# Altium schematic sheet USB_UART.SchDoc
size A4
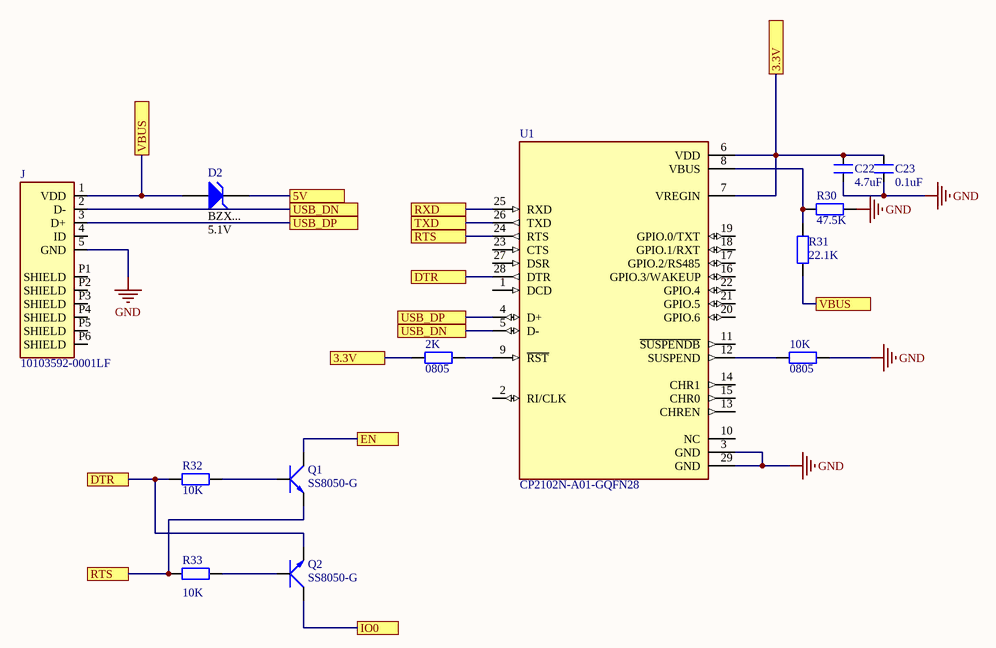
[diagram p0: USB_UART.SchDoc]

## Parts
2K  value 0805  [DIEN TRO 0805]  (hidden comment: RES_SMD_0805)
10K  value 0805  [DIEN TRO 0805]  (hidden comment: RES_SMD_0805)
C22  4.7uF  [SM-0805]
C23  0.1uF  [SM-0805]
D2  value BZX...  Volt: 5.1V  [D1208]  (hidden comment: Diode Zener)
J  10103592-0001LF  [AMPHENOL_10103592-0001LF]
Q1  SS8050-G  [SOT23B]
Q2  SS8050-G  [SOT23B]
R30  value 47.5K  [DIEN TRO 0805]  (hidden comment: RES_SMD_0805)
R31  value 22.1K  [DIEN TRO 0805]  (hidden comment: RES_SMD_0805)
R32  value 10K  [DIEN TRO 0805]  (hidden comment: RES_SMD_0805)
R33  value 10K  [DIEN TRO 0805]  (hidden comment: RES_SMD_0805)
U1  CP2102N-A01-GQFN28  [QFN50P500X500X80-29N]

## Ports
3.3V, 5V, DTR, EN, IO0, RTS, RXD, TXD, USB_DN, USB_DP, VBUS

## Nets
GND: 10K.2 C22.1 C23.1 J.5(GND) R30.2 U1.3(GND) U1.29(GND)
3.3V: 2K.1 C22.2 C23.2 U1.6(VDD) U1.7(VREGIN) ; port 3.3V
5V: D2.2(K) ; port 5V
DTR: Q2.1(E) R32.1 U1.28(DTR) ; port DTR
EN: Q1.2(C) ; port EN
IO0: Q2.2(C) ; port IO0
RTS: Q1.1(E) R33.1 U1.24(RTS) ; port RTS
RXD: U1.25(RXD) ; port RXD
TXD: U1.26(TXD) ; port TXD
USB_DN: J.2(D-) U1.5(D-) ; port USB_DN
USB_DP: J.3(D+) U1.4(D+) ; port USB_DP
VBUS: D2.1(A) J.1(VDD) R31.1 ; port VBUS
Net2K_2: 2K.2 U1.9(~{RST})
Net10K_1: 10K.1 U1.12(SUSPEND)
NetQ1_3: Q1.3(B) R32.2
NetQ2_3: Q2.3(B) R33.2
NetR30_1: R30.1 R31.2 U1.8(VBUS)

Not connected (* = marked no-connect by the designer): J 4(ID) P1(SHIELD) P2(SHIELD) P3(SHIELD) P4(SHIELD) P5(SHIELD) P6(SHIELD); U1 1(DCD) 2(RI/CLK) 10(NC) 11(~{SUSPENDB}) 13(CHREN) 14(CHR1) 15(CHR0) 16(GPIO.3/WAKEUP) 17(GPIO.2/RS485) 18(GPIO.1/RXT) 19(GPIO.0/TXT) 20(GPIO.6) 21(GPIO.5) 22(GPIO.4) 23(CTS) 27(DSR)

## Library data of the parts
2K 10K R30-R33 = RES_SMD_0805: RES_0805; Published: 8-Jun-2000; LatestRevisionDate: 17-Jul-2002; LatestRevisionNote: Re-released for DXP Platform.; PackageReference: AXIAL-0.4; Publisher: Altium Limited
C22 C23 = CM: Cap SMD; Value: 103
D2 = Diode Zener: Zener Diode; Vendor: Digikey; Published: 8-Jun-2000; LatestRevisionDate: 17-Jul-2002; LatestRevisionNote: Re-released for DXP Platform.; PackageReference: DIODE-0.7; Publisher: Altium Limited; ComponentLink1Description: Digikey Part Link; ComponentLink2Description: Open Datasheet; ComponentLink2URL: H:\LIBRARY\LIBRARY.Datasheet\
J = 10103592-0001LF: USB - micro B USB 2.0 Receptacle Connector 5 Position Surface Mount, Right Angle; Through Hole; MF: Amphenol ICC; SnapEDA_Link: https://www.snapeda.com/parts/10103592-0001LF/Amphenol%20FCI/view-part/1274744/?ref=snap; Availability: Unavailable; Value: *; Price: None; MP: 10103592-0001LF; Package: None
Q1 Q2 = C1815_1: NPN 600mW, ECB; Value: C1815
U1 = CP2102N-A01-GQFN28: USB Bridge, USB to UART USB 2.0 UART Interface 28-QFN (5x5); MF: Silicon Labs; SnapEDA_Link: https://www.snapeda.com/parts/CP2102N-A01-GQFN28/Silicon%20Labs/view-part/554799/?ref=snap; MP: CP2102N-A01-GQFN28; Price: None; Package: QFN-28 Silicon Labs; Check_prices: https://www.snapeda.com/parts/CP2102N-A01-GQFN28/Silicon%20Labs/view-part/554799/?ref=eda; Value: *; Availability: Bad